# EAGLE schematic Project (EAGLE 9.6.2)
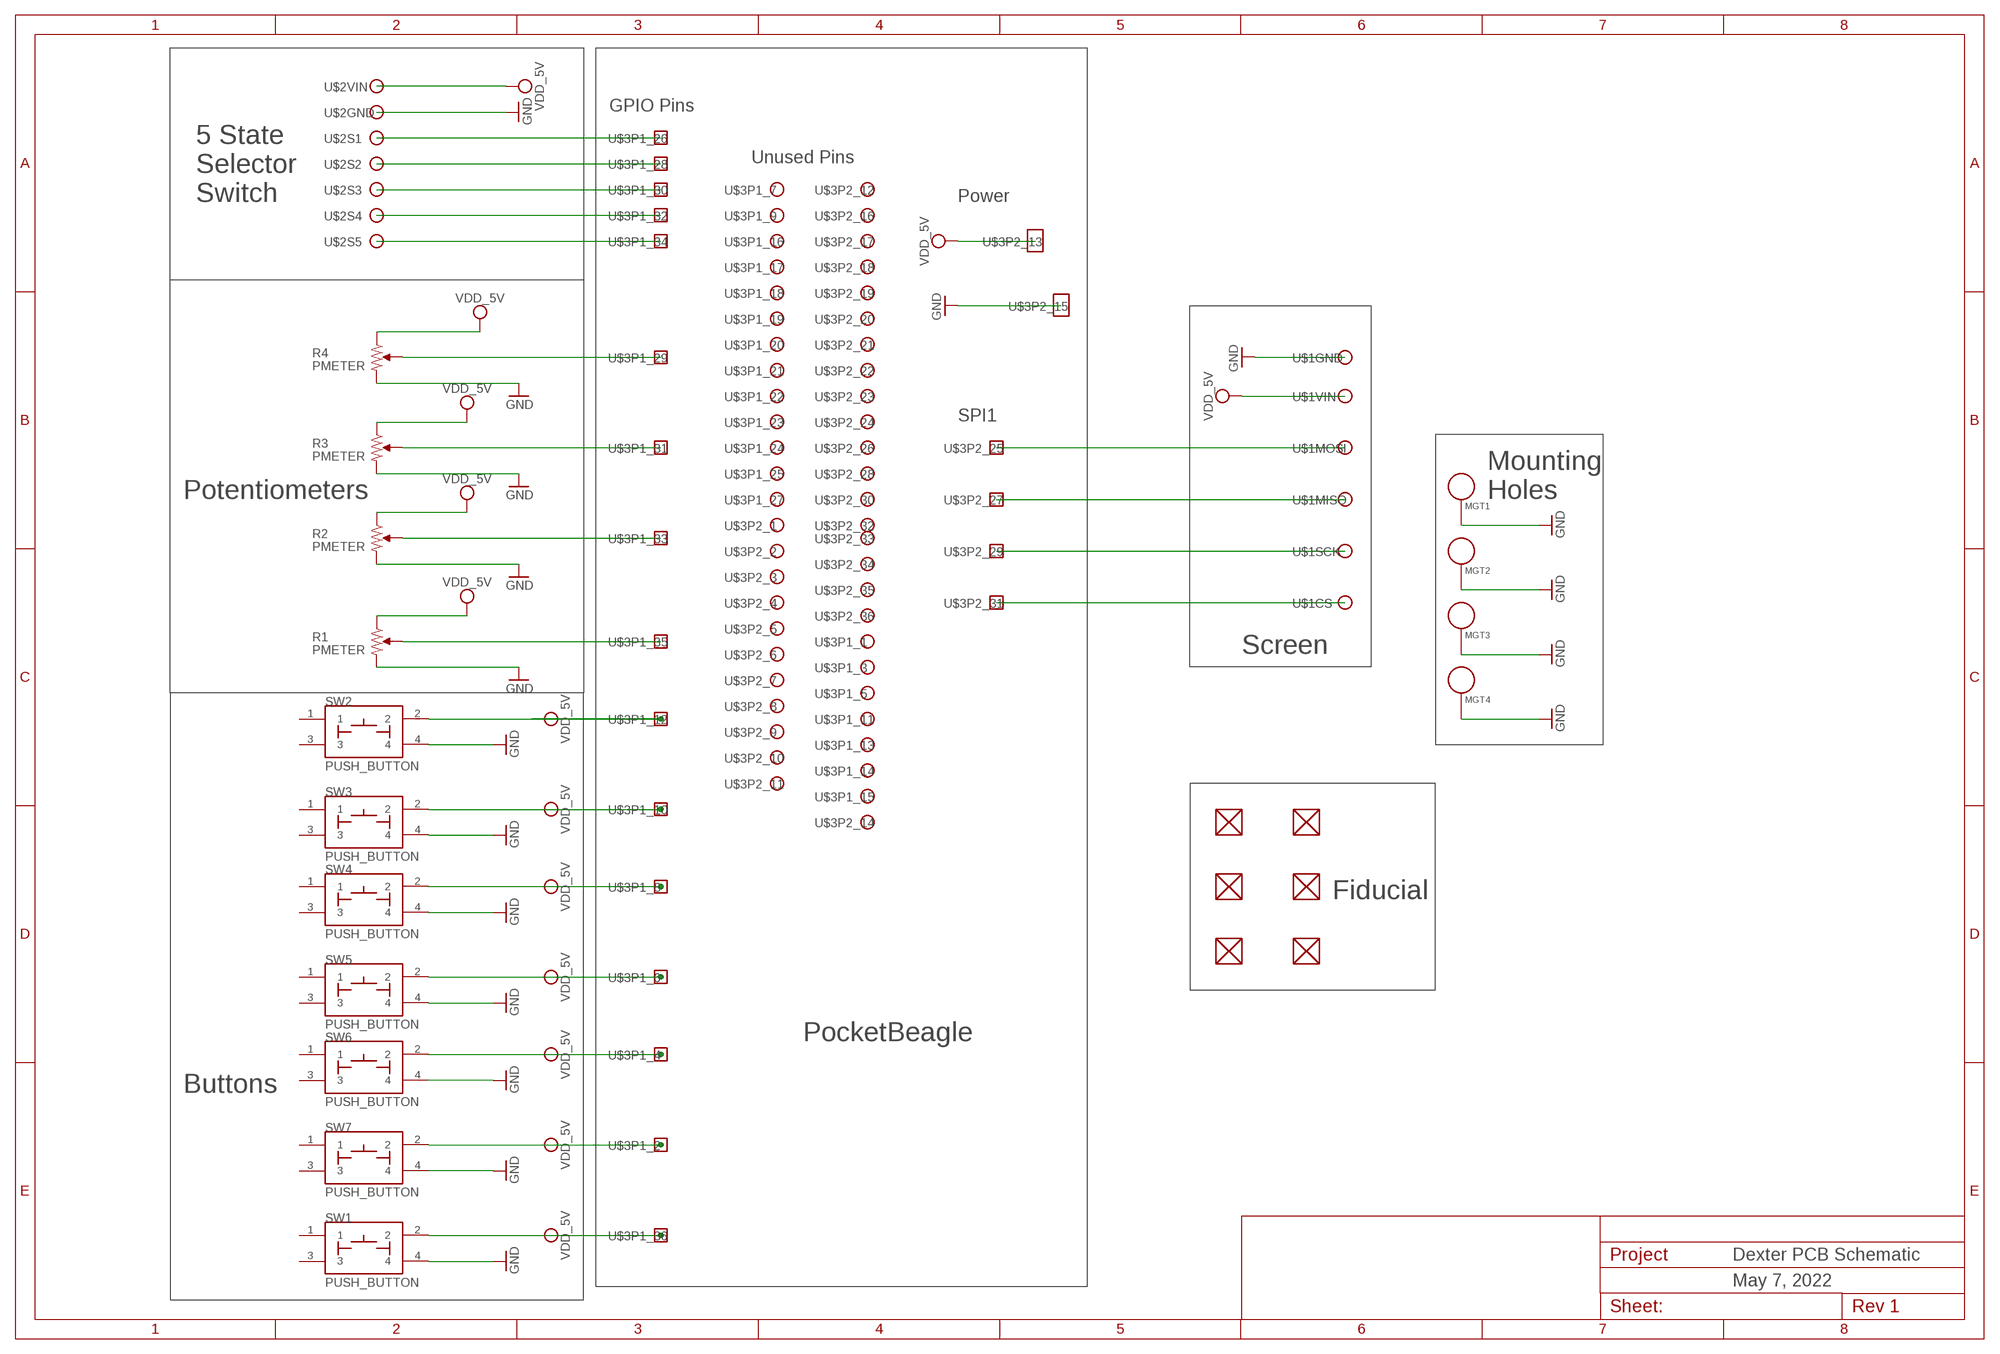
[diagram p0: schematic, sheet 1]

## Parts
FUD1  FIDUCIAL  [FIDUCIAL_40MIL]
FUD2  FIDUCIAL  [FIDUCIAL_40MIL]
FUD3  FIDUCIAL  [FIDUCIAL_40MIL]
FUD4  FIDUCIAL  [FIDUCIAL_40MIL]
FUD5  FIDUCIAL  [FIDUCIAL_40MIL]
FUD6  FIDUCIAL  [FIDUCIAL_40MIL]
MGT1  MOUNTING_HOLE  [MOUNTING_HOLE]
MGT2  MOUNTING_HOLE  [MOUNTING_HOLE]
MGT3  MOUNTING_HOLE  [MOUNTING_HOLE]
MGT4  MOUNTING_HOLE  [MOUNTING_HOLE]
R1  PMETER  [POT-PO90S]
R2  PMETER  [POT-PO90S]
R3  PMETER  [POT-PO90S]
R4  PMETER  [POT-PO90S]
SW1  PUSH_BUTTON  [BUTTON_12.5MM]
SW2  PUSH_BUTTON  [BUTTON_12.5MM]
SW3  PUSH_BUTTON  [BUTTON_12.5MM]
SW4  PUSH_BUTTON  [BUTTON_12.5MM]
SW5  PUSH_BUTTON  [BUTTON_12.5MM]
SW6  PUSH_BUTTON  [BUTTON_12.5MM]
SW7  PUSH_BUTTON  [BUTTON_12.5MM]
U$1  SCREEN  [SCREEN]
U$2  SELECTOR_SWITCH  [SELECTOR_SWITCH]
U$3  POCKETBEAGLE  [POCKETBEAGLE]

## Nets
GND: MGT1.P$1 MGT2.P$1 MGT3.P$1 MGT4.P$1 R1.CW R2.CW R3.CW R4.CW SW1.4 SW2.4 SW3.4 SW4.4 SW5.4 SW6.4 SW7.4 U$1.1@JP1 U$2.P$2 U$3.15@P2
N$2: U$2.P$3 U$3.26@P1
N$3: U$2.P$4 U$3.28@P1
N$4: U$2.P$5 U$3.30@P1
N$5: U$2.P$6 U$3.32@P1
N$6: R3.S U$3.31@P1
N$7: R2.S U$3.33@P1
N$8: R1.S U$3.35@P1
N$15: U$2.P$7 U$3.34@P1
N$16: R4.S U$3.29@P1
N$17: U$1.6@JP1 U$3.25@P2
N$18: U$1.7@JP1 U$3.27@P2
N$19: U$1.8@JP1 U$3.29@P2
N$20: U$1.5@JP1 U$3.31@P2
VDD_5V: R1.CCW R2.CCW R3.CCW R4.CCW SW1.2 SW2.2 SW3.2 SW4.2 SW5.2 SW6.2 SW7.2 U$1.2@JP1 U$2.P$1 U$3.2@P1 U$3.4@P1 U$3.6@P1 U$3.8@P1 U$3.10@P1 U$3.12@P1 U$3.13@P2 U$3.36@P1
Unconnected: FUD1.P$1 FUD2.P$1 FUD3.P$1 FUD4.P$1 FUD5.P$1 FUD6.P$1 SW1.1 SW1.3 SW2.1 SW2.3 SW3.1 SW3.3 SW4.1 SW4.3 SW5.1 SW5.3 SW6.1 SW6.3 SW7.1 SW7.3 U$3.1@P1 U$3.1@P2 U$3.2@P2 U$3.3@P1 U$3.3@P2 U$3.4@P2 U$3.5@P1 U$3.5@P2 U$3.6@P2 U$3.7@P1 U$3.7@P2 U$3.8@P2 U$3.9@P1 U$3.9@P2 U$3.10@P2 U$3.11@P1 U$3.11@P2 U$3.12@P2 U$3.13@P1 U$3.14@P1 U$3.14@P2 U$3.15@P1 U$3.16@P1 U$3.16@P2 U$3.17@P1 U$3.17@P2 U$3.18@P1 U$3.18@P2 U$3.19@P1 U$3.19@P2 U$3.20@P1 U$3.20@P2 U$3.21@P1 U$3.21@P2 U$3.22@P1 U$3.22@P2 U$3.23@P1 U$3.23@P2 U$3.24@P1 U$3.24@P2 U$3.25@P1 U$3.26@P2 U$3.27@P1 U$3.28@P2 U$3.30@P2 U$3.32@P2 U$3.33@P2 U$3.34@P2 U$3.35@P2 U$3.36@P2

## Notes on the sheet
- GPIO Pins
- Unused Pins
- 5 State 
  Selector 
  Switch
- Power
- SPI1
- Potentiometers
- Mounting 
  Holes
- Screen
- Fiducial
- PocketBeagle
- Buttons
- Dexter PCB Schematic
- May 7, 2022

## Library data of the parts
FUD1-FUD6 = Project:FIDUCIAL
MGT1-MGT4 = Project:MOUNTING_HOLE: Chassis Mounting Hole w/GND connection ability
R1-R4 = Project:PMETER: Potentiometer - Examples: P090S-14T20BR10K (987-1277-ND)
SW1-SW7 = Project:PUSH_BUTTON
U$1 = Project:SCREEN
U$2 = Project:SELECTOR_SWITCH
U$3 = Project:POCKETBEAGLE: PocketBeagle Board